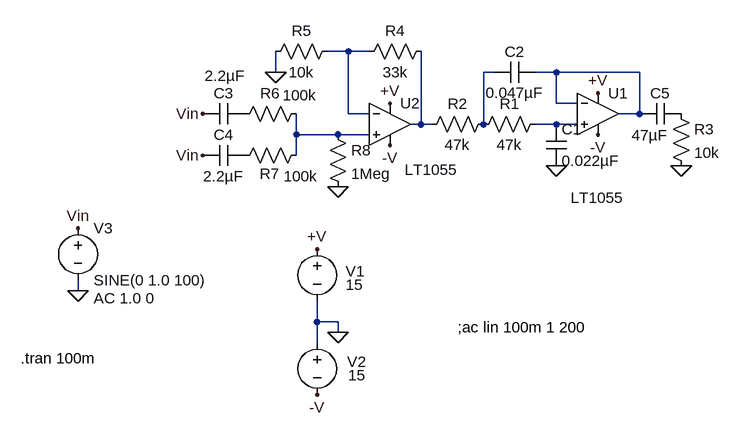
[diagram p0: schematic 100Hz Subwoofer Filter.asc]
100Hz Subwoofer Filter.asc, the LTspice schematic file:
Version 4
SHEET 1 880 680
WIRE -240 48 -272 48
WIRE -208 48 -240 48
WIRE -352 80 -352 48
WIRE -16 80 -32 80
WIRE 80 80 48 80
WIRE 208 80 80 80
WIRE 80 128 80 80
WIRE 112 128 80 128
WIRE -240 144 -240 48
WIRE -208 144 -240 144
WIRE 208 144 208 80
WIRE 208 144 176 144
WIRE -128 160 -128 48
WIRE -128 160 -144 160
WIRE -112 160 -128 160
WIRE -32 160 -32 80
WIRE 80 160 48 160
WIRE 112 160 80 160
WIRE -320 176 -320 144
WIRE -256 176 -320 176
WIRE -208 176 -256 176
WIRE -320 208 -320 176
WIRE -656 416 -656 400
WIRE -288 464 -288 432
WIRE -256 464 -288 464
WIRE -256 480 -256 464
WIRE -288 496 -288 464
FLAG 144 112 +V
FLAG -288 352 +V
FLAG 144 176 -V
FLAG -288 576 -V
FLAG -464 144 Vin
FLAG -656 320 Vin
FLAG -656 416 0
FLAG -256 480 0
FLAG 80 224 0
FLAG 272 224 0
FLAG -176 128 +V
FLAG -176 192 -V
FLAG -352 80 0
FLAG -256 256 0
FLAG -464 208 Vin
SYMBOL cap 64 160 R0
SYMATTR InstName C1
SYMATTR Value 0.022µF
SYMBOL cap 48 64 R90
WINDOW 0 0 32 VBottom 2
WINDOW 3 32 32 VTop 2
SYMATTR InstName C2
SYMATTR Value 0.047µF
SYMBOL res 64 144 R90
WINDOW 0 0 56 VBottom 2
WINDOW 3 32 56 VTop 2
SYMATTR InstName R1
SYMATTR Value 47k
SYMBOL res -16 144 R90
WINDOW 0 0 56 VBottom 2
WINDOW 3 32 56 VTop 2
SYMATTR InstName R2
SYMATTR Value 47k
SYMBOL voltage -288 336 R0
WINDOW 0 44 50 Left 2
WINDOW 3 44 71 Left 2
SYMATTR InstName V1
SYMATTR Value 15
SYMATTR SpiceLine Rser=0.1
SYMBOL voltage -288 480 R0
WINDOW 0 46 45 Left 2
WINDOW 3 48 66 Left 2
SYMATTR InstName V2
SYMATTR Value 15
SYMATTR SpiceLine Rser=0.1
SYMBOL voltage -656 304 R0
WINDOW 123 24 124 Left 2
SYMATTR InstName V3
SYMATTR Value SINE(0 1.0 100)
SYMATTR Value2 AC 1.0 0
SYMATTR SpiceLine Rser=1
SYMBOL OpAmps\\LT1055 144 80 R0
WINDOW 3 -42 193 Left 2
SYMATTR InstName U1
SYMBOL res 256 128 R0
SYMATTR InstName R3
SYMATTR Value 10k
SYMBOL OpAmps\\LT1055 -176 96 R0
WINDOW 3 23 134 Left 2
SYMATTR InstName U2
SYMBOL res -112 32 R90
WINDOW 0 0 56 VBottom 2
WINDOW 3 32 56 VTop 2
SYMATTR InstName R4
SYMATTR Value 33k
SYMBOL res -256 32 R90
WINDOW 0 0 56 VBottom 2
WINDOW 3 32 56 VTop 2
SYMATTR InstName R5
SYMATTR Value 10k
SYMBOL res -304 128 R90
WINDOW 0 0 56 VBottom 2
WINDOW 3 -28 11 VTop 2
SYMATTR InstName R6
SYMATTR Value 100k
SYMBOL res -304 192 R90
WINDOW 0 60 57 VBottom 2
WINDOW 3 32 9 VTop 2
SYMATTR InstName R7
SYMATTR Value 100k
SYMBOL res -272 160 R0
SYMATTR InstName R8
SYMATTR Value 1Meg
SYMBOL cap -400 128 R90
WINDOW 0 0 32 VBottom 2
WINDOW 3 -58 30 VTop 2
SYMATTR InstName C3
SYMATTR Value 2.2µF
SYMBOL cap -400 192 R90
WINDOW 0 0 32 VBottom 2
WINDOW 3 32 32 VTop 2
SYMATTR InstName C4
SYMATTR Value 2.2µF
SYMBOL cap 272 128 R90
WINDOW 0 0 32 VBottom 2
WINDOW 3 33 48 VTop 2
SYMATTR InstName C5
SYMATTR Value 47µF
TEXT -72 472 Left 2 !;ac lin 100m 1 200
TEXT -744 520 Left 2 !.tran 100m

The netlist it stands for:
* 100Hz Subwoofer Filter.asc
C1 N005 0 0.022µF
C2 N003 N002 0.047µF
R1 N005 N002 47k
R2 N002 N004 47k
V1 +V 0 15 Rser=0.1
V2 0 -V 15 Rser=0.1
V3 Vin 0 SINE(0 1.0 100) AC 1.0 0 Rser=1
XU1 N005 N003 +V -V N003 LT1055  ; pins In+ In- V+ V- OUT
R3 P001 0 10k
XU2 N006 N001 +V -V N004 LT1055  ; pins In+ In- V+ V- OUT
R4 N004 N001 33k
R5 N001 0 10k
R6 N006 P002 100k
R7 N006 P003 100k
R8 N006 0 1Meg
C3 P002 Vin 2.2µF
C4 P003 Vin 2.2µF
C5 P001 N003 47µF
;ac lin 100m 1 200
.tran 100m
.backanno
.end